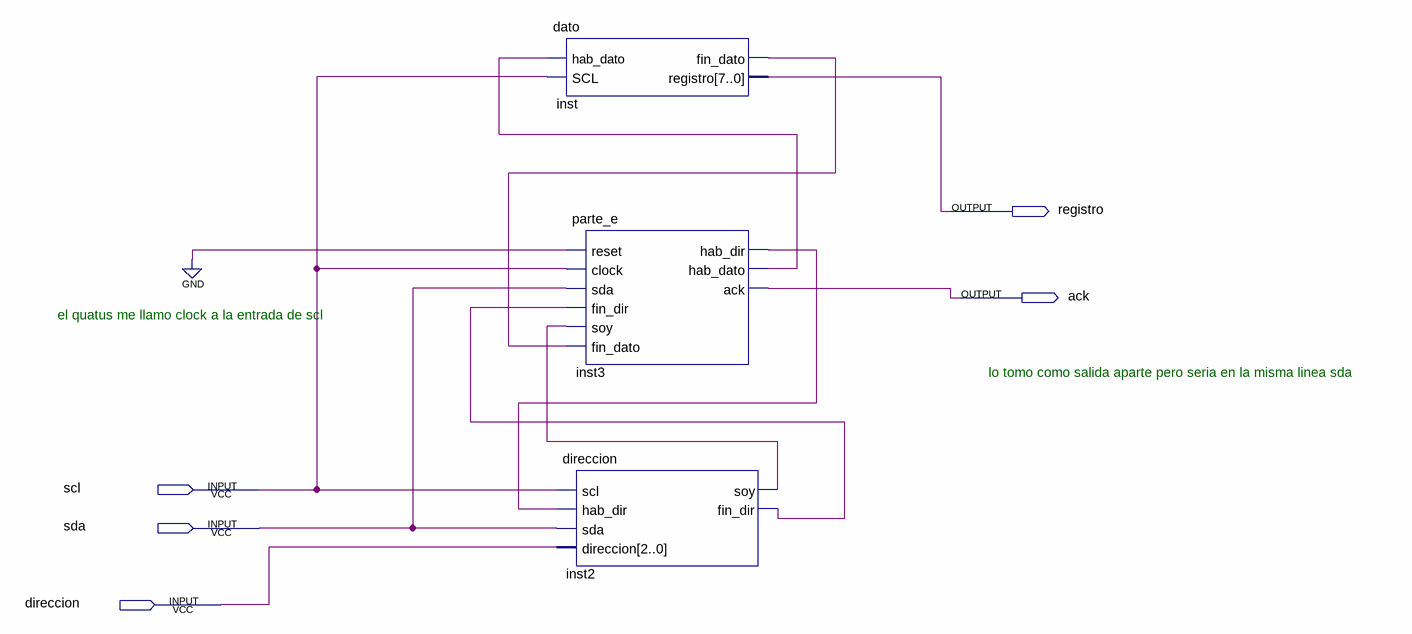
[diagram p0: schematic sheet]
// Quartus schematic implementacion_final.bdf as structural Verilog: 3 symbols, 5 pins
module implementacion_final (
  input  scl,
  input  sda,
  input  direccion,
  output registro,
  output ack
);

  wire inst2_fin_dir, inst2_soy, inst3_hab_dato, inst3_hab_dir, inst_fin_dato;

  dato inst (.hab_dato(inst3_hab_dato), .SCL(scl), .fin_dato(inst_fin_dato), .registro(registro));
  parte_e inst3 (
    .reset(1'b0), .clock(scl), .sda(sda), .fin_dir(inst2_fin_dir), .soy(inst2_soy), .fin_dato(inst_fin_dato),
    .hab_dir(inst3_hab_dir), .hab_dato(inst3_hab_dato), .ack(ack));
  direccion inst2 (
    .scl(scl), .hab_dir(inst3_hab_dir), .sda(sda), .direccion({3{direccion}}), .soy(inst2_soy),
    .fin_dir(inst2_fin_dir));

  // Notes on the sheet:
  //   el quatus me llamo clock a la entrada de scl
  //   lo tomo como salida aparte pero seria en la misma linea sda
endmodule
